# EAGLE design stm32-canstamp (EAGLE 5.12)

## Sheet 1 of 2
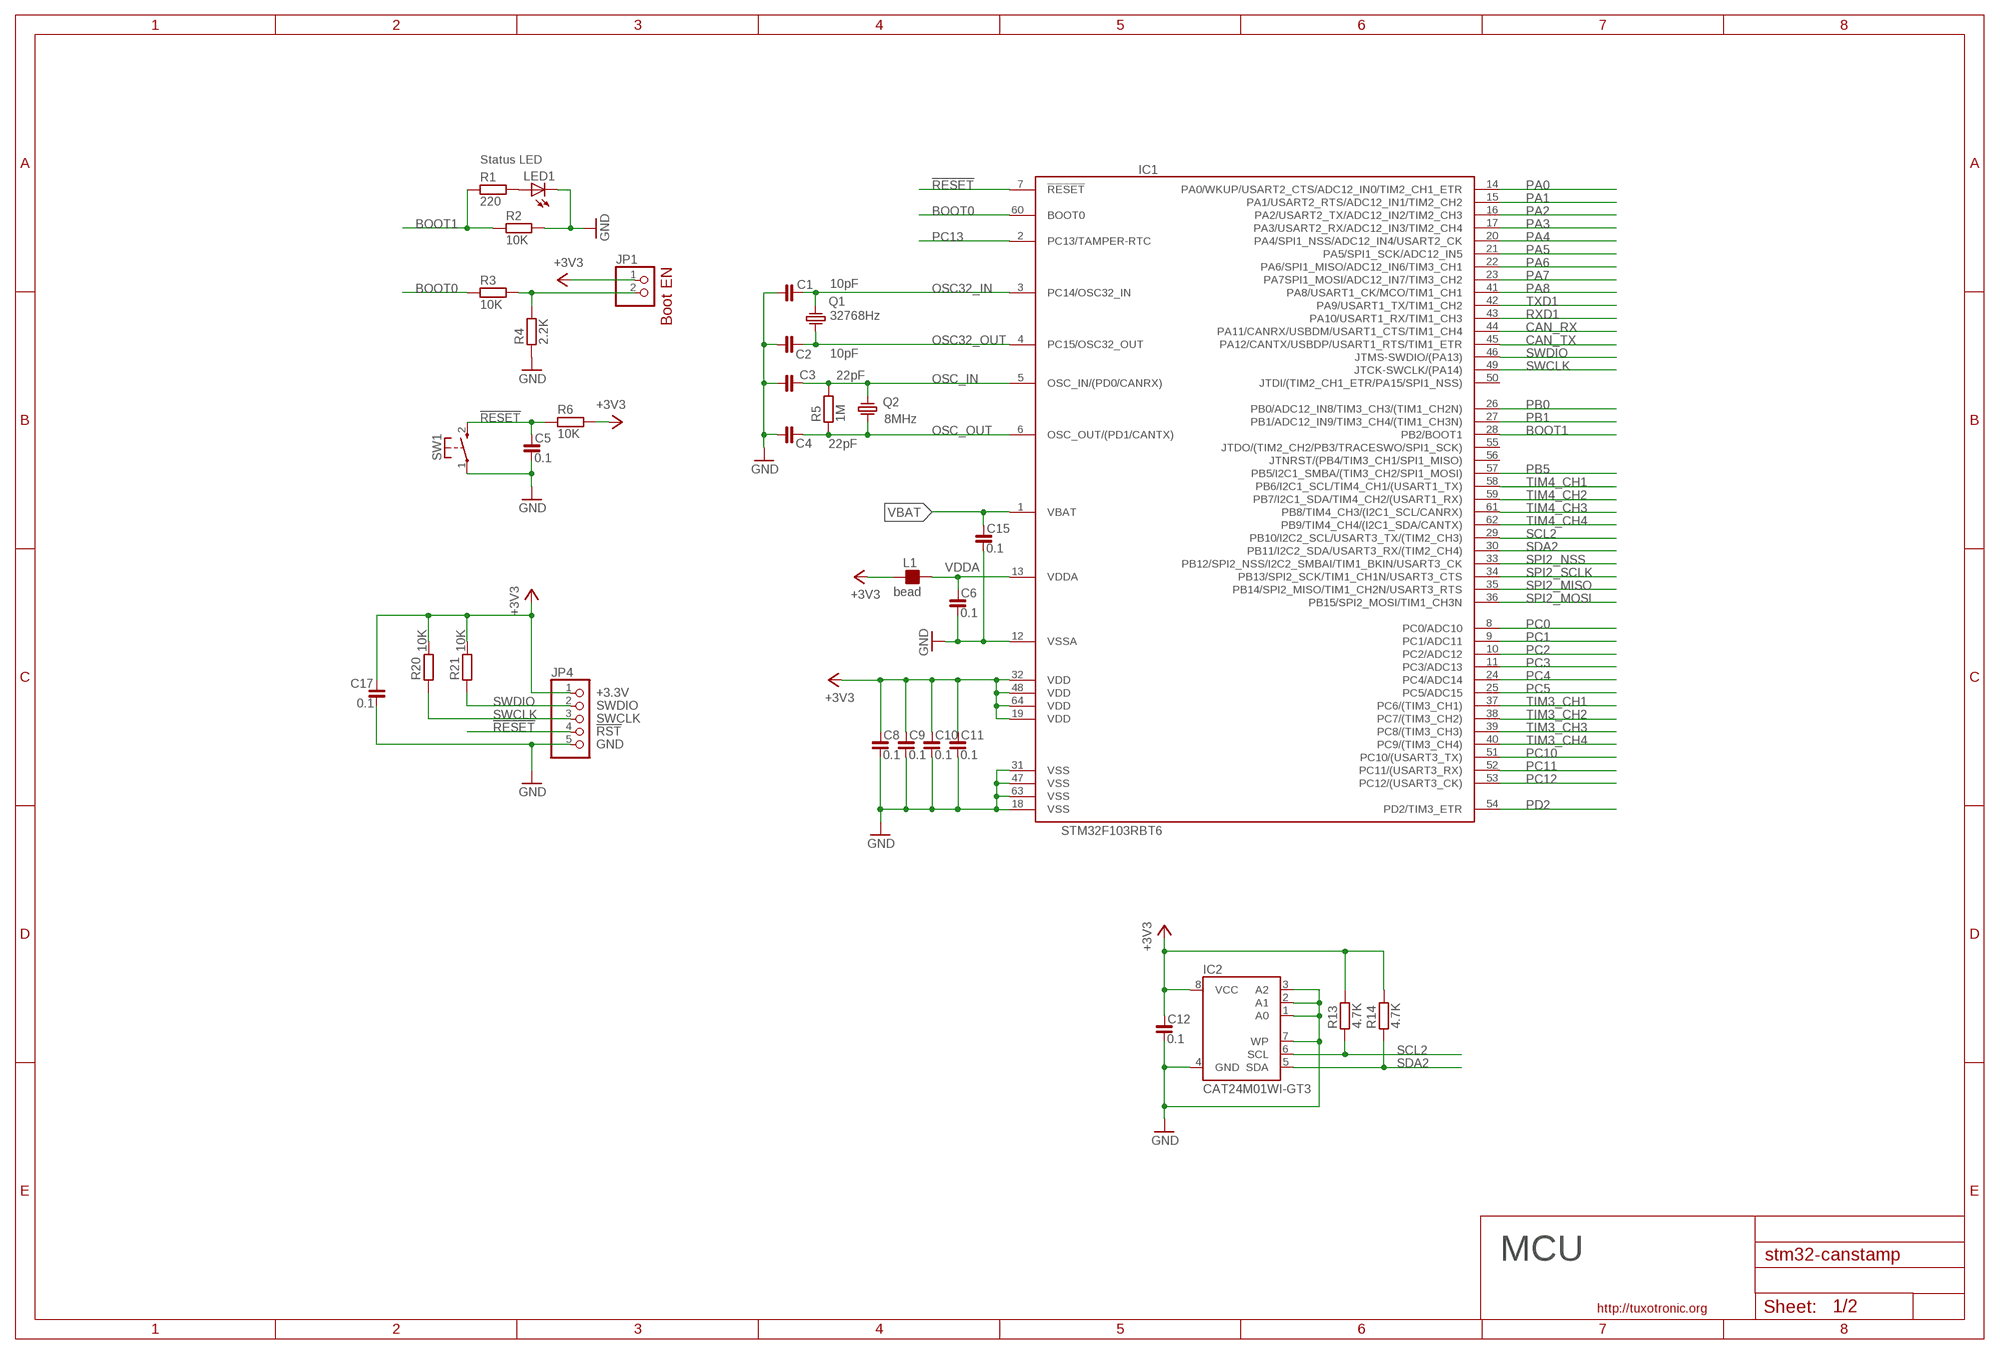
[diagram p0: schematic, sheet 1]

### Parts
C1  10pF  C_0603  [C0603]
C2  10pF  C_0603  [C0603]
C3  22pF  C_0603  [C0603]
C4  22pF  C_0603  [C0603]
C5  0.1  C_0603  [C0603]
C6  0.1  C_0603  [C0603]
C8  0.1  C_0603  [C0603]
C9  0.1  C_0603  [C0603]
C10  0.1  C_0603  [C0603]
C11  0.1  C_0603  [C0603]
C12  0.1  C_0603  [C0603]
C15  0.1  C_0603  [C0603]
C17  0.1  C_0603  [C0603]
IC1  STM32F103RBT6  STM32F103R  [TQFP64]
IC2  CAT24M01WI-GT3  AT24C256S  [SO08]
JP1  PINHD-1X2_2.00  [1X02M]
JP4  SWD-5_2.54  [1X05]
L1  bead  FB_0603  [L0603]
LED1  LEDCHIP-LED0805  [CHIP-LED0805]
Q1  32768Hz  CRYSTAL-TC26H  [TC26H]
Q2  8MHz  CRYSTAL-HC49S  [HC49/S]
R1  220  R_0603  [R0603]
R2  10K  R_0603  [R0603]
R3  10K  R_0603  [R0603]
R4  2.2K  R_0603  [R0603]
R5  1M  R_0603  [R0603]
R6  10K  R_0603  [R0603]
R13  4.7K  R_0603  [R0603]
R14  4.7K  R_0603  [R0603]
R20  10K  R_0603  [R0603]
R21  10K  R_0603  [R0603]
SW1  KSS-2EG4430  [KSS-2EG4430]

### Nets
!RESET: C5.1 IC1.7(!RESET) JP4.4 R6.1 SW1.2(S)
+3V3: C8.1 C9.1 C10.1 C11.1 C12.1 C17.1 IC1.19(VDD) IC1.32(VDD) IC1.48(VDD) IC1.64(VDD) IC2.8(VCC) JP1.1 JP4.1 L1.1 R6.2 R13.2 R14.2 R20.2 R21.2 ; also sheet 2
BOOT0: IC1.60(BOOT0) R3.1
BOOT1: IC1.28(PB2/BOOT1) R1.1 R2.1
CAN_RX: IC1.44(PA11/CANRX/USBDM/USART1_CTS/TIM1_CH4) ; also sheet 2
CAN_TX: IC1.45(PA12/CANTX/USBDP/USART1_RTS/TIM1_ETR) ; also sheet 2
GND: C1.2 C2.2 C3.2 C4.2 C5.2 C6.2 C8.2 C9.2 C10.2 C11.2 C12.2 C15.2 C17.2 IC1.12(VSSA) IC1.18(VSS) IC1.31(VSS) IC1.47(VSS) IC1.63(VSS) IC2.1(A0) IC2.2(A1) IC2.3(A2) IC2.4(GND) IC2.7(WP) JP4.5 LED1.C R2.2 R4.1 SW1.1(P) ; also sheet 2
N$3: JP1.2 R3.2 R4.2
N$30: LED1.A R1.2
OSC32_IN: C1.1 IC1.3(PC14/OSC32_IN) Q1.2 ; also sheet 2
OSC32_OUT: C2.1 IC1.4(PC15/OSC32_OUT) Q1.1 ; also sheet 2
OSC_IN: C3.1 IC1.5(OSC_IN/(PD0/CANRX)) Q2.1 R5.2
OSC_OUT: C4.1 IC1.6(OSC_OUT/(PD1/CANTX)) Q2.2 R5.1
PA0: IC1.14(PA0/WKUP/USART2_CTS/ADC12_IN0/TIM2_CH1_ETR) ; also sheet 2
PA1: IC1.15(PA1/USART2_RTS/ADC12_IN1/TIM2_CH2) ; also sheet 2
PA2: IC1.16(PA2/USART2_TX/ADC12_IN2/TIM2_CH3) ; also sheet 2
PA3: IC1.17(PA3/USART2_RX/ADC12_IN3/TIM2_CH4) ; also sheet 2
PA4: IC1.20(PA4/SPI1_NSS/ADC12_IN4/USART2_CK) ; also sheet 2
PA5: IC1.21(PA5/SPI1_SCK/ADC12_IN5) ; also sheet 2
PA6: IC1.22(PA6/SPI1_MISO/ADC12_IN6/TIM3_CH1) ; also sheet 2
PA7: IC1.23(PA7SPI1_MOSI/ADC12_IN7/TIM3_CH2) ; also sheet 2
PA8: IC1.41(PA8/USART1_CK/MCO/TIM1_CH1)
PB0: IC1.26(PB0/ADC12_IN8/TIM3_CH3/(TIM1_CH2N)) ; also sheet 2
PB1: IC1.27(PB1/ADC12_IN9/TIM3_CH4/(TIM1_CH3N)) ; also sheet 2
PB5: IC1.57(PB5/I2C1_SMBA/(TIM3_CH2/SPI1_MOSI)) ; also sheet 2
PC0: IC1.8(PC0/ADC10) ; also sheet 2
PC1: IC1.9(PC1/ADC11) ; also sheet 2
PC2: IC1.10(PC2/ADC12) ; also sheet 2
PC3: IC1.11(PC3/ADC13) ; also sheet 2
PC4: IC1.24(PC4/ADC14) ; also sheet 2
PC5: IC1.25(PC5/ADC15) ; also sheet 2
PC10: IC1.51(PC10/(USART3_TX)) ; also sheet 2
PC11: IC1.52(PC11/(USART3_RX)) ; also sheet 2
PC12: IC1.53(PC12/(USART3_CK)) ; also sheet 2
PC13: IC1.2(PC13/TAMPER-RTC) ; also sheet 2
PD2: IC1.54(PD2/TIM3_ETR) ; also sheet 2
RXD1: IC1.43(PA10/USART1_RX/TIM1_CH3)
SCL2: IC1.29(PB10/I2C2_SCL/USART3_TX/(TIM2_CH3)) IC2.6(SCL) R13.1 ; also sheet 2
SDA2: IC1.30(PB11/I2C2_SDA/USART3_RX/(TIM2_CH4)) IC2.5(SDA) R14.1 ; also sheet 2
SPI2_MISO: IC1.35(PB14/SPI2_MISO/TIM1_CH2N/USART3_RTS) ; also sheet 2
SPI2_MOSI: IC1.36(PB15/SPI2_MOSI/TIM1_CH3N) ; also sheet 2
SPI2_NSS: IC1.33(PB12/SPI2_NSS/I2C2_SMBAI/TIM1_BKIN/USART3_CK) ; also sheet 2
SPI2_SCLK: IC1.34(PB13/SPI2_SCK/TIM1_CH1N/USART3_CTS) ; also sheet 2
SWCLK: IC1.49(JTCK-SWCLK/(PA14)) JP4.3 R20.1
SWDIO: IC1.46(JTMS-SWDIO/(PA13)) JP4.2 R21.1
TIM3_CH1: IC1.37(PC6/(TIM3_CH1)) ; also sheet 2
TIM3_CH2: IC1.38(PC7/(TIM3_CH2)) ; also sheet 2
TIM3_CH3: IC1.39(PC8/(TIM3_CH3)) ; also sheet 2
TIM3_CH4: IC1.40(PC9/(TIM3_CH4)) ; also sheet 2
TIM4_CH1: IC1.58(PB6/I2C1_SCL/TIM4_CH1/(USART1_TX)) ; also sheet 2
TIM4_CH2: IC1.59(PB7/I2C1_SDA/TIM4_CH2/(USART1_RX)) ; also sheet 2
TIM4_CH3: IC1.61(PB8/TIM4_CH3/(I2C1_SCL/CANRX)) ; also sheet 2
TIM4_CH4: IC1.62(PB9/TIM4_CH4/(I2C1_SDA/CANTX)) ; also sheet 2
TXD1: IC1.42(PA9/USART1_TX/TIM1_CH2)
VBAT: C15.1 IC1.1(VBAT) ; also sheet 2
VDDA: C6.1 IC1.13(VDDA) L1.2 ; also sheet 2
Unconnected: IC1.50(JTDI/(TIM2_CH1_ETR/PA15/SPI1_NSS)) IC1.55(JTDO/(TIM2_CH2/PB3/TRACESWO/SPI1_SCK)) IC1.56(JTNRST/(PB4/TIM3_CH1/SPI1_MISO))

### Notes on the sheet
- Status LED
- Boot EN
- MCU

## Sheet 2 of 2
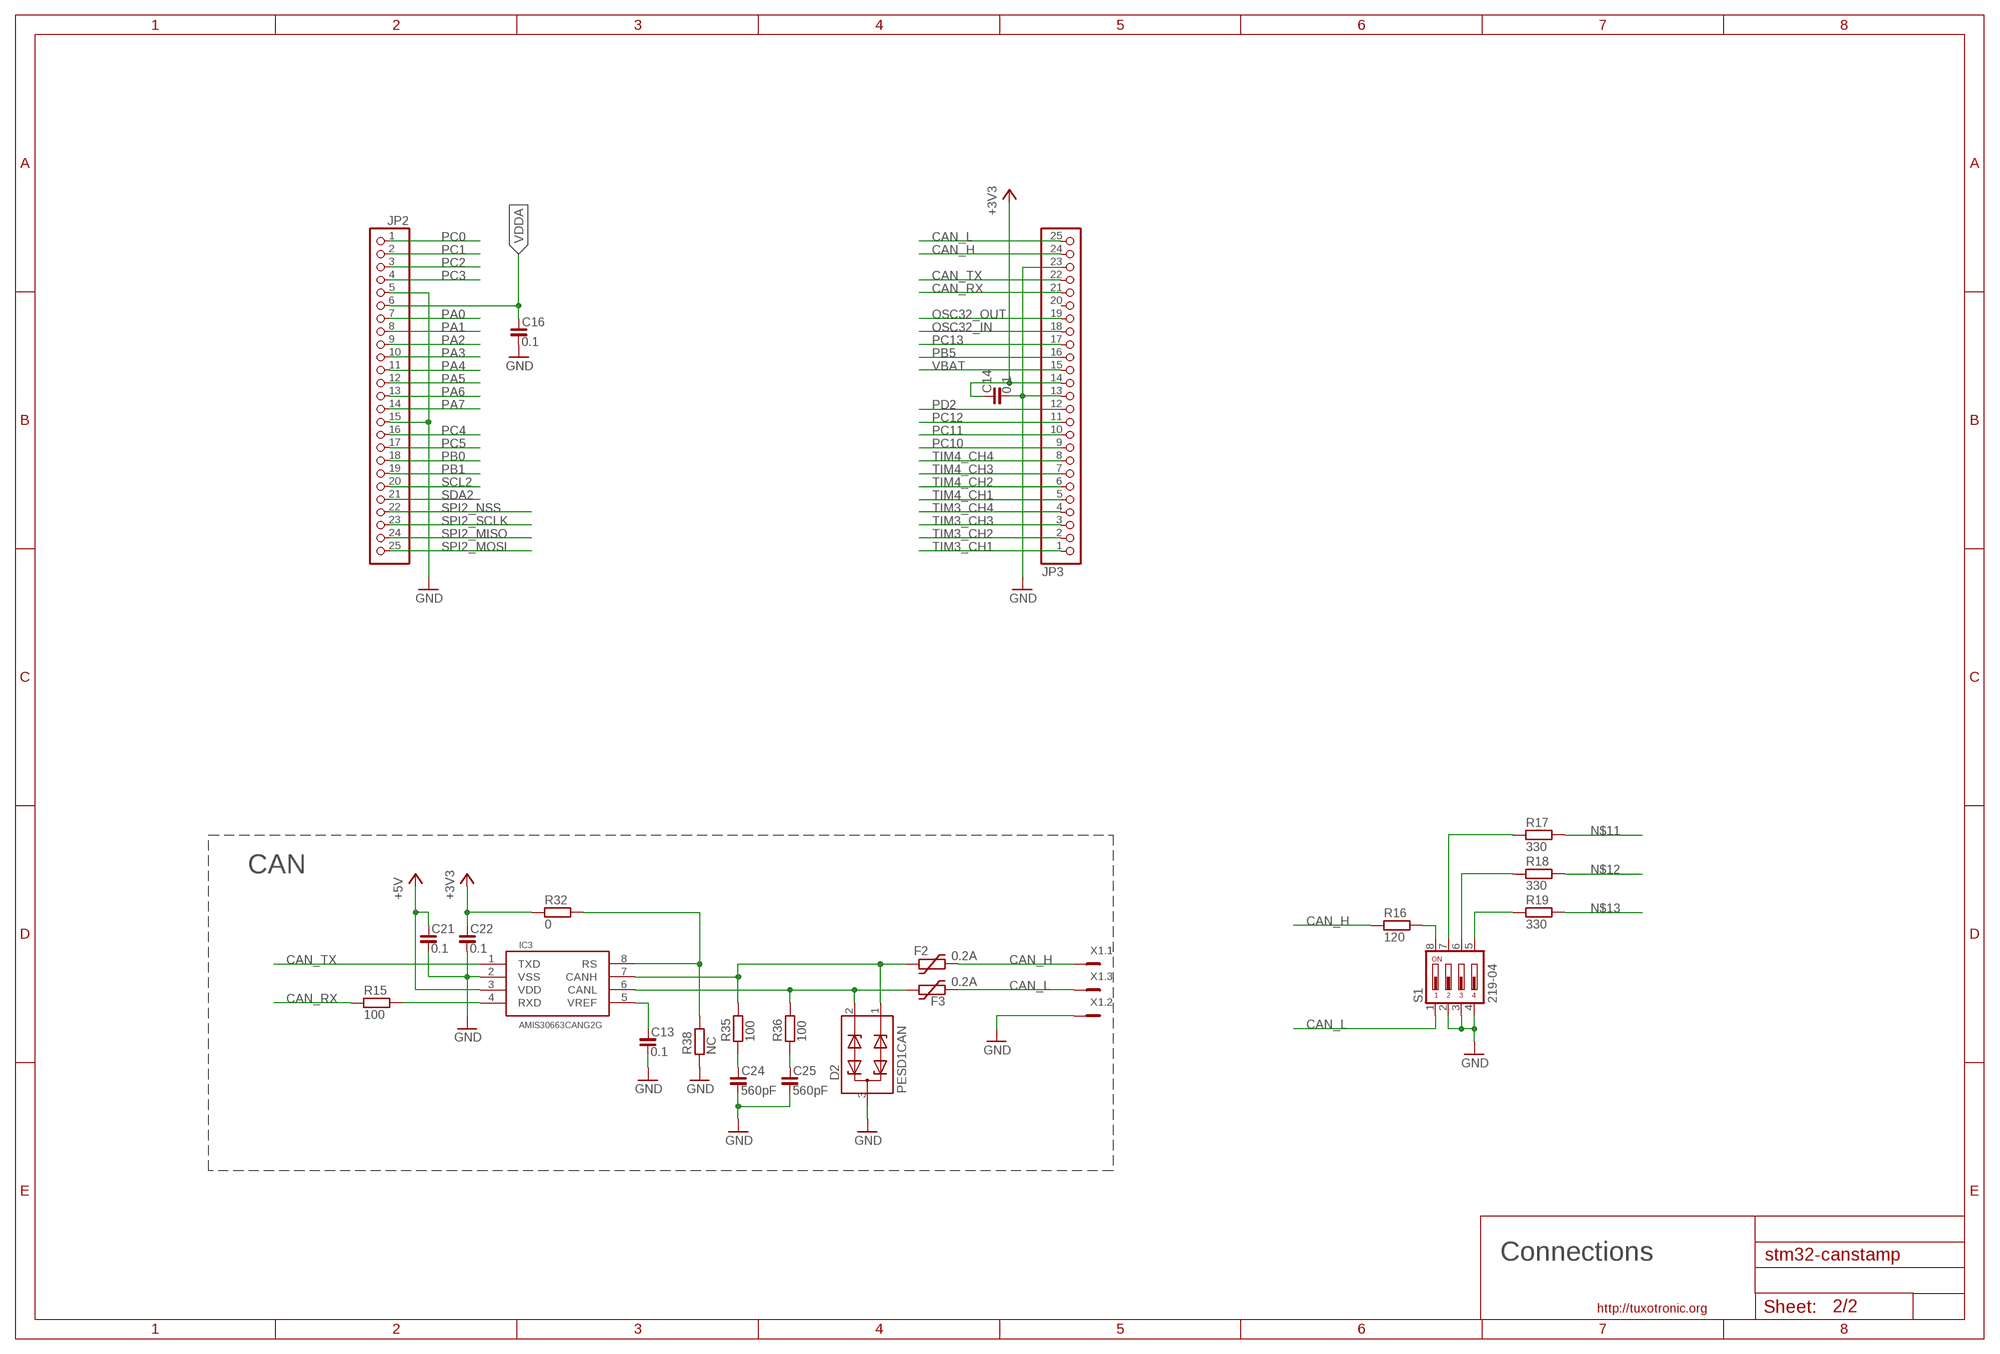
[diagram p1: schematic, sheet 2]

### Parts
C13  0.1  C_0603  [C0603]
C14  0.1  C_0603  [C0603]
C16  0.1  C_0603  [C0603]
C21  0.1  C_0603  [C0603]
C22  0.1  C_0603  [C0603]
C24  560pF  C_0603  [C0603]
C25  560pF  C_0603  [C0603]
D2  PESD1CAN  [SOT23]
F2  0.2A  1812L  [1812L]
F3  0.2A  1812L  [1812L]
IC3  AMIS30663CANG2G  SN65HVD230  [SO08]
JP2  PINHD-1X25_2.00  [1X25M]
JP3  PINHD-1X25_2.00  [1X25M]
R15  100  R_0603  [R0603]
R16  120  R_0805  [R0805]
R17  330  R_0603  [R0603]
R18  330  R_0603  [R0603]
R19  330  R_0603  [R0603]
R32  0  R_0603  [R0603]
R35  100  R_0603  [R0603]
R36  100  R_0603  [R0603]
R38  NC  R_0603  [R0603]
S1  219-04  [CTS-219-04]
X1  MCV3  [MCV3]

### Nets
+3V3: C14.1 C22.1 JP3.14 R32.1 ; also sheet 1
+5V: C21.1 IC3.3(VDD)
CAN_CTRL: IC3.8(RS) R32.2 R38.2
CAN_H: F2.P$2 JP3.24 R16.1 X1.1
CAN_L: F3.P$2 JP3.25 S1.1 X1.3
CAN_RX: JP3.21 R15.1 ; also sheet 1
CAN_TX: IC3.1(TXD) JP3.22 ; also sheet 1
GND: C13.2 C14.2 C16.2 C21.2 C22.2 C24.2 C25.2 D2.3 IC3.2(VSS) JP2.5 JP2.15 JP3.13 JP3.23 R38.1 S1.2 S1.3 S1.4 X1.2 ; also sheet 1
N$1: C13.1 IC3.5(VREF)
N$2: R16.2 S1.8
N$7: IC3.4(RXD) R15.2
N$8: R17.1 S1.7
N$9: R18.1 S1.6
N$10: R19.1 S1.5
N$11: R17.2
N$12: R18.2
N$13: R19.2
N$51: D2.1 F2.P$1 IC3.7(CANH) R35.2
N$52: D2.2 F3.P$1 IC3.6(CANL) R36.2
N$54: C25.1 R36.1
N$55: C24.1 R35.1
OSC32_IN: JP3.18 ; also sheet 1
OSC32_OUT: JP3.19 ; also sheet 1
PA0: JP2.7 ; also sheet 1
PA1: JP2.8 ; also sheet 1
PA2: JP2.9 ; also sheet 1
PA3: JP2.10 ; also sheet 1
PA4: JP2.11 ; also sheet 1
PA5: JP2.12 ; also sheet 1
PA6: JP2.13 ; also sheet 1
PA7: JP2.14 ; also sheet 1
PB0: JP2.18 ; also sheet 1
PB1: JP2.19 ; also sheet 1
PB5: JP3.16 ; also sheet 1
PC0: JP2.1 ; also sheet 1
PC1: JP2.2 ; also sheet 1
PC2: JP2.3 ; also sheet 1
PC3: JP2.4 ; also sheet 1
PC4: JP2.16 ; also sheet 1
PC5: JP2.17 ; also sheet 1
PC10: JP3.9 ; also sheet 1
PC11: JP3.10 ; also sheet 1
PC12: JP3.11 ; also sheet 1
PC13: JP3.17 ; also sheet 1
PD2: JP3.12 ; also sheet 1
SCL2: JP2.20 ; also sheet 1
SDA2: JP2.21 ; also sheet 1
SPI2_MISO: JP2.24 ; also sheet 1
SPI2_MOSI: JP2.25 ; also sheet 1
SPI2_NSS: JP2.22 ; also sheet 1
SPI2_SCLK: JP2.23 ; also sheet 1
TIM3_CH1: JP3.1 ; also sheet 1
TIM3_CH2: JP3.2 ; also sheet 1
TIM3_CH3: JP3.3 ; also sheet 1
TIM3_CH4: JP3.4 ; also sheet 1
TIM4_CH1: JP3.5 ; also sheet 1
TIM4_CH2: JP3.6 ; also sheet 1
TIM4_CH3: JP3.7 ; also sheet 1
TIM4_CH4: JP3.8 ; also sheet 1
VBAT: JP3.15 ; also sheet 1
VDDA: C16.1 JP2.6 ; also sheet 1
Unconnected: JP3.20

### Notes on the sheet
- CAN
- Connections

## Library data of the parts
C1-C6 C8-C17 C21 C22 C24 C25 = rc-master-smd:C_: NON-POLARIZED CAP
D2 = protect:PESD1CAN: Features Due to the integrated diode structure only one small SOT23 package is needed to protect two CAN bus lines Max. peak pulse power: PPP = 200 W at tp = 8/20 ?s Low clamping voltage: VCL = 40 V at IPP = 1 A Ultra low leakage current: IRM < 1 nA ESD protection up to 23 kV IEC 61000-4-2, level 4 (ESD) IEC 61000-4-5 (surge); IPP = 3 A at tp = 8/20 ?s Small SMD plastic package Applications CAN bus protection Automotive applications
F2 F3 = discrete:1812L
IC1 = stm32:STM32F103R: Medium-density performance line ARM-based 32-bit MCU with 64 or 128 KB Flash, USB, CAN, 7 timers, 2 ADCs, 9 communication interfaces
IC2 = stm32-by-pb:AT24C*: 2-wire serial EEPROM
IC3 = interfaces:SN65HVD230: CAN PHY driver
JP1 = pinhead-fixdrills:PINHD-1X2: PIN HEADER
JP2 JP3 = pinhead-fixdrills:PINHD-1X25: PIN HEADER
JP4 = jtag:SWD-5: PIN HEADER
L1 = rc-master-smd:FB_: FERRITE BEAD
LED1 = led:LED: LED OSRAM: - CHIPLED LG R971, LG N971, LY N971, LG Q971, LY Q971, LO R971, LY R971 LH N974, LH R974 LS Q976, LO Q976, LY Q976 LO Q996 - Hyper CHIPLED LW Q18S LB Q993, LB Q99A, LB R99A - SideLED LS A670, LO A670, LY A670, LG A670, LP A670 LB A673, LV A673, LT A673, LW A673 LH A674 LY A675 LS A676, LA A676, LO A676, LY A676, LW A676 LS A679, LY A679, LG A679 - Hyper Micro SIDELED® LS Y876, LA Y876, LO Y876, LY Y876 LT Y87S - SmartLED LW L88C, LW L88S LB L89C, LB L89S, LG L890 LS L89K, LO L89K, LY L89K LS L896, LA L896, LO L896, LY L896 - TOPLED LS T670, LO T670, LY T670, LG T670, LP T670 LSG T670, LSP T670, LSY T670, LOP T670, LYG T670 LG T671, LOG T671, LSG T671 LB T673, LV T673, LT T673, LW T673 LH T674 LS T676, LA T676, LO T676, LY T676, LB T676, LH T676, LSB T676, LW T676 LB T67C, LV T67C, LT T67C, LS T67K, LO T67K, LY T67K, LW E67C LS E67B, LA E67B, LO E67B, LY E67B, LB E67C, LV E67C, LT E67C LW T67C LS T679, LY T679, LG T679 LS T770, LO T770, LY T770, LG T770, LP T770 LB T773, LV T773, LT T773, LW T773 LH T774 LS E675, LA E675, LY E675, LS T675 LS T776, LA T776, LO T776, LY T776, LB T776 LHGB T686 LT T68C, LB T68C - Hyper Mini TOPLED® LB M676 - Mini TOPLED Santana® LG M470 LS M47K, LO M47K, LY M47K Source: http://www.osram.convergy.de - LUMILED® LXK2-PW12-R00, LXK2-PW12-S00, LXK2-PW14-U00, LXK2-PW14-V00 LXK2-PM12-R00, LXK2-PM12-S00, LXK2-PM14-U00 LXK2-PE12-Q00, LXK2-PE12-R00, LXK2-PE12-S00, LXK2-PE14-T00, LXK2-PE14-U00 LXK2-PB12-K00, LXK2-PB12-L00, LXK2-PB12-M00, LXK2-PB14-N00, LXK2-PB14-P00, LXK2-PB14-Q00 LXK2-PR12-L00, LXK2-PR12-M00, LXK2-PR14-Q00, LXK2-PR14-R00 LXK2-PD12-Q00, LXK2-PD12-R00, LXK2-PD12-S00 LXK2-PH12-R00, LXK2-PH12-S00 LXK2-PL12-P00, LXK2-PL12-Q00, LXK2-PL12-R00 Source: www.luxeon.com
Q1 Q2 = discrete:CRYSTAL-: CRYSTAL
R1-R6 R13-R21 R32 R35 R36 R38 = rc-master-smd:R_: RESISTOR
S1 = switch-dil:219-04*: Surface Mount DIP Switch Series 219 SMT CTS Electronic Components Sourc: www.ctscorp.com
SW1 = buttons:KSS-2EG4430: Size: 3x6mm Height: 5mm from PCB Rating: DC12v 50mA Travel: 0.25±0.10mm Operating Force: 180±50gf Return Force: 60gf min Contact resistance: 100m? max Insulation resistance: 100M? min Operating life?50,000 cycles
X1 = con-phoenix-381_l:MCV3: Mini-Combicon 3.81mm vertikal 3polig (ohne Gegenstecker)

## Net classes
0 default: width 0.1 mm, drill 0.1 mm, clearance 0.1 mm

## Board
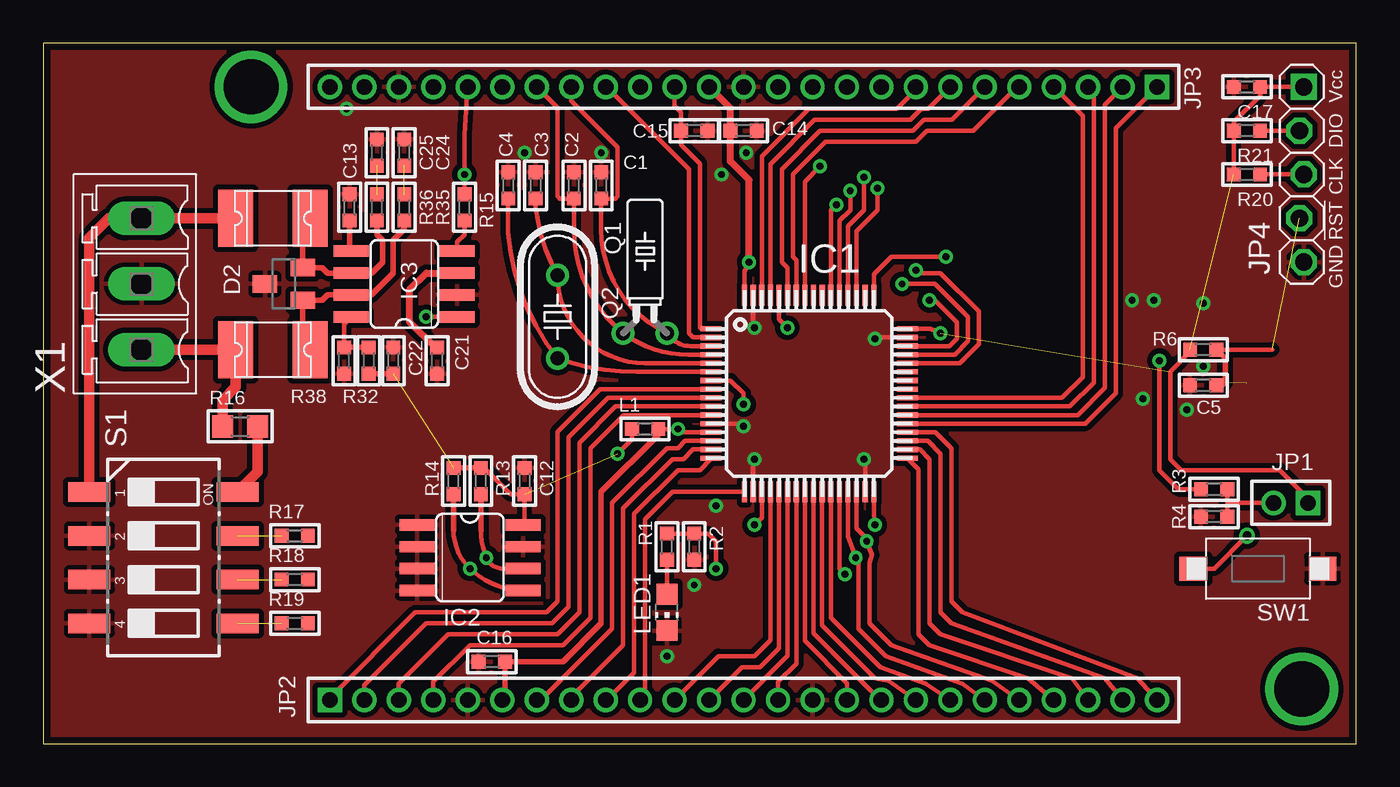
[diagram p2: board, top side]
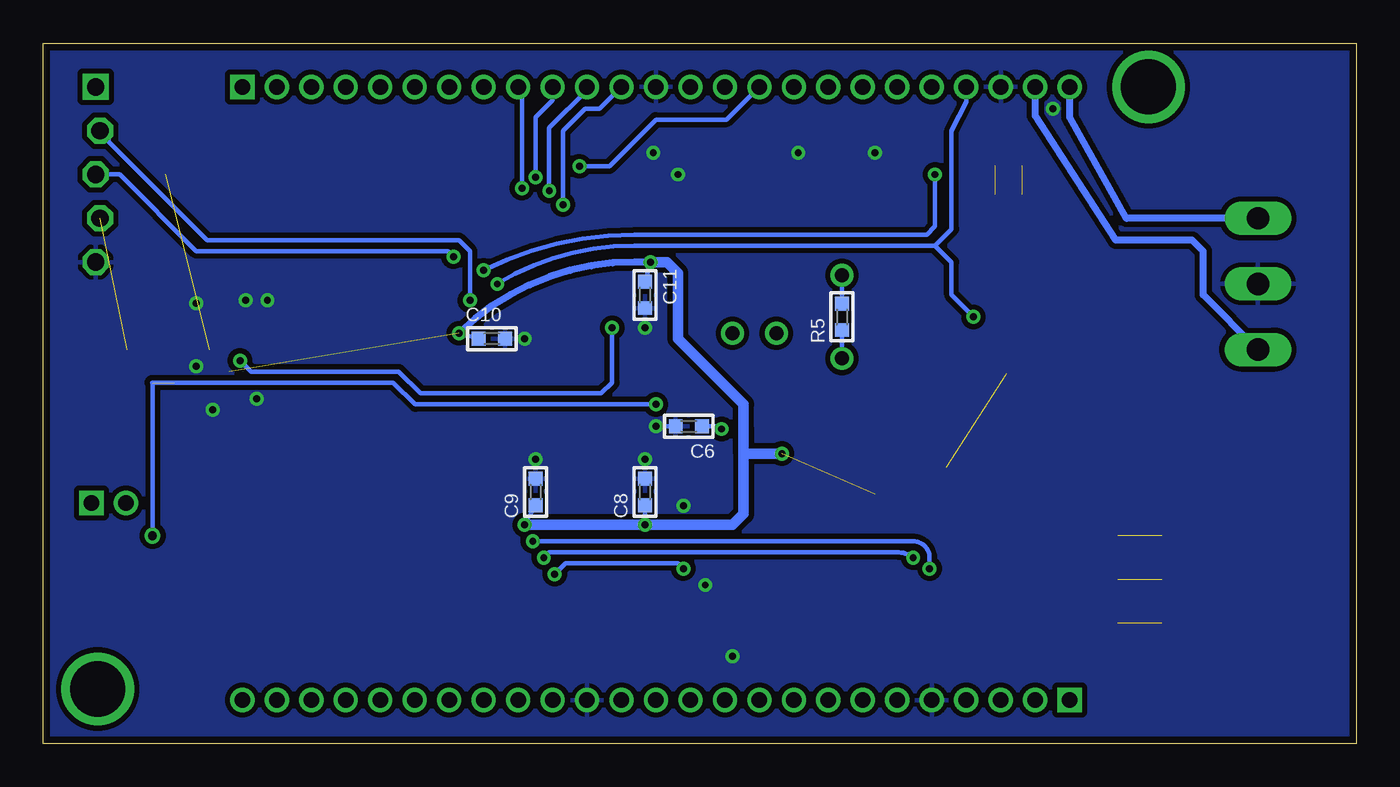
[diagram p3: board, bottom side, seen from below]

Size 76.2 x 40.64 mm. Coordinates in mm from the lower left corner, seen from the top.
Outline: 0,0 76.2,0 76.2,40.64 0,40.64 0,0
Copper layers (1*16): Top 0.035mm / dielectric 1.5mm / Bottom 0.035mm
Design rules "default *": minimum track width 0.16mm, minimum drill 0.4mm, track to track 0.16mm, track to pad 0.16mm, pad to pad 0.16mm, via to via 0.16mm, smd to smd 0.16mm, copper to edge 0.4mm, drill to drill 8mil, minimum pad ring 10mil, minimum via ring 8mil, stop-mask expansion 4mil, vias tented up to drill 0.6mm, thermal gap 10mil

### Footprints (pad centres in the part's own frame; a part is rotated, then mirrored left to right if it is on the bottom)
C0603 = smd 0.8 x 0.8: 1 -0.762,0; 2 0.762,0
SOT23 = smd 1 x 1.4: 1 -0.95,-1.1; 2 0.95,-1.1; 3 0,1.1
1812L = smd 2.03 x 3.3: P$1 -2.16,0; P$2 2.16,0
TQFP64 = smd 1.2 x 0.3: 1 -5.7,3.75; 2 -5.7,3.25; 3 -5.7,2.75; 4 -5.7,2.25; 5 -5.7,1.75; 6 -5.7,1.25; 7 -5.7,0.75; 8 -5.7,0.25; 9 -5.7,-0.25; 10 -5.7,-0.75; 11 -5.7,-1.25; 12 -5.7,-1.75; 13 -5.7,-2.25; 14 -5.7,-2.75; 15 -5.7,-3.25; 16 -5.7,-3.75; 33 5.7,-3.75; 34 5.7,-3.25; 35 5.7,-2.75; 36 5.7,-2.25; 37 5.7,-1.75; 38 5.7,-1.25; 39 5.7,-0.75; 40 5.7,-0.25; 41 5.7,0.25; 42 5.7,0.75; 43 5.7,1.25; 44 5.7,1.75; 45 5.7,2.25; 46 5.7,2.75; 47 5.7,3.25; 48 5.7,3.75 | smd 0.3 x 1.2: 17 -3.75,-5.7; 18 -3.25,-5.7; 19 -2.75,-5.7; 20 -2.25,-5.7; 21 -1.75,-5.7; 22 -1.25,-5.7; 23 -0.75,-5.7; 24 -0.25,-5.7; 25 0.25,-5.7; 26 0.75,-5.7; 27 1.25,-5.7; 28 1.75,-5.7; 29 2.25,-5.7; 30 2.75,-5.7; 31 3.25,-5.7; 32 3.75,-5.7; 49 3.75,5.7; 50 3.25,5.7; 51 2.75,5.7; 52 2.25,5.7; 53 1.75,5.7; 54 1.25,5.7; 55 0.75,5.7; 56 0.25,5.7; 57 -0.25,5.7; 58 -0.75,5.7; 59 -1.25,5.7; 60 -1.75,5.7; 61 -2.25,5.7; 62 -2.75,5.7; 63 -3.25,5.7; 64 -3.75,5.7
SO08 = smd 0.66 x 2.032: 1 -1.905,-3.073; 2 -0.635,-3.073; 3 0.635,-3.073; 4 1.905,-3.073; 5 1.905,3.073; 6 0.635,3.073; 7 -0.635,3.073; 8 -1.905,3.073
1X02M = drill 0.9 square: 1 -1,0 | drill 0.9 round: 2 1,0
1X25M = drill 0.9 square: 1 -24,0 | drill 0.9 round: 2 -22,0; 3 -20,0; 4 -18,0; 5 -16,0; 6 -14,0; 7 -12,0; 8 -10,0; 9 -8,0; 10 -6,0; 11 -4,0; 12 -2,0; 13 0,0; 14 2,0; 15 4,0; 16 6,0; 17 8,0; 18 10,0; 19 12,0; 20 14,0; 21 16,0; 22 18,0; 23 20,0; 24 22,0; 25 24,0
1X05 = drill 1 square: 1 -5.08,0.127 | drill 1 octagon: 2 -2.54,-0.127; 3 0,0.127; 4 2.54,-0.127; 5 5.08,0.127
L0603 = smd 0.8 x 0.8: 1 -0.762,0; 2 0.762,0
CHIP-LED0805 = smd 1.2 x 1.2: A 0,-1.05; C 0,1.05
TC26H = drill 0.813 round: 1 -1.27,0; 2 1.27,0
HC49/S = drill 0.813 round: 1 -2.413,0; 2 2.413,0
R0603 = smd 0.8 x 0.8: 1 -0.762,0; 2 0.762,0
R0805 = smd 1.2 x 1.3: 1 -1.016,0; 2 1.016,0
CTS-219-04 = smd 1.13 x 2.44: 1 -3.81,-4.3; 2 -1.27,-4.3; 3 1.27,-4.3; 4 3.81,-4.3; 5 3.81,4.3; 6 1.27,4.3; 7 -1.27,4.3; 8 -3.81,4.3
KSS-2EG4430 = smd 1.6 x 1.4: 1 -3.75,0; 2 3.75,0
MCV3 = drill 1.3 pad 1.905 long: 1 -3.81,0; 2 0,0; 3 3.81,0

### Placement (x,y rotation side)
C1  32.38,32.38 90 top
C2  30.8,32.38 90 top
C3  28.57,32.38 90 top
C4  26.99,32.39 90 top
C5  67.31,20.8 180 top
C6  38.73,18.41 180 bottom
C8  41.27,14.61 90 bottom
C9  47.62,14.61 90 bottom
C10  50.16,23.5 0 bottom
C11  41.27,26.04 270 bottom
C12  27.94,15.24 90 top
C13  17.78,31.11 90 top
C14  40.64,35.56 0 top
C15  37.78,35.56 0 top
C16  26.04,4.76 180 top
C17  69.85,38.1 180 top
C21  22.86,22.23 270 top
C22  20.32,22.23 90 top
C24  20.96,34.29 90 top
C25  19.37,34.29 90 top
D2  13.97,26.67 90 top
F2  13.34,22.86 180 top
F3  13.34,30.48 180 top
IC1  44.45,20.32 0 top
IC2  24.77,10.79 270 top
IC3  20.96,26.67 90 top
JP1  72.39,13.97 180 top
JP2  40.64,2.54 0 top
JP3  40.64,38.1 180 top
JP4  73.02,33.02 270 top
L1  34.93,18.26 0 top
LED1  36.2,7.62 180 top
Q1  34.93,23.81 0 top
Q2  29.84,24.77 270 top
R1  36.2,11.43 270 top
R2  37.78,11.43 270 top
R3  67.94,14.76 0 top
R4  67.94,13.18 0 top
R5  29.84,24.77 90 bottom
R6  67.31,22.86 180 top
R13  25.4,15.24 90 top
R14  23.81,15.24 90 top
R15  24.45,31.11 270 top
R16  11.43,18.41 0 top
R17  14.61,12.06 0 top
R18  14.61,9.53 0 top
R19  14.61,6.99 0 top
R20  69.85,33.02 180 top
R21  69.85,35.56 180 top
R32  18.89,22.23 90 top
R35  20.96,31.11 270 top
R36  19.37,31.11 270 top
R38  17.46,22.23 90 top
S1  6.99,10.79 270 top
SW1  70.48,10.16 180 top
X1  5.72,26.67 90 top

### Tracks (layer width: path | path; a pad name or v marks a point on that pad's centre or on a via)
!RESET  (via drill 0.4, 0.5)  (2 unrouted)
  Top 0.254: IC1.7 39.89,21.07 40.64,20.32 v40.64,19.68 | R6.1 71.31,22.86 | SW1.2 67.94,10.16 v69.85,12.06
  Top 0.305: C5.1 68.42,20.8 68.58,20.95 68.58,22.35 R6.1
  Bottom 0.254: v40.64,19.68 54.61,19.68 55.88,20.95 69.88,20.95 69.85,20.92 v69.85,12.06
+3V3  (via drill 0.4)  (4 unrouted)
  Top 0.254: IC1.64 40.7,27.36 v40.96,27.94 | IC1.19 41.7,13.12 v41.27,12.7 | IC1.32 48.2,13.28 v48.26,12.7 | IC1.48 51.49,24.07 v52.07,23.81 | R13.2 25.59,16 27.11,14.48 C12.1 27.94,12.8 IC2.8 | L1.1 34.16,17.65 v33.34,16.83 | JP1.1 73.39,14.24 71.75,15.88 66.04,15.88 65.4,16.51 65.4,21.59 66.55,22.73 R6.2 | JP4.1 C17.1 70.61,37.59 69.09,36.07 R21.2 R20.2
  Top 0.305: R32.1 C22.1 | R13.2 R14.2
  Top 0.406: JP3.14 39.88,36.86 C14.1 39.88,33.78 40.96,32.7 v40.96,27.94
  Bottom 0.254: v40.96,27.94 C11.1 | v41.27,12.7 C8.1 | v48.26,12.7 C9.1 | v52.07,23.81 C10.1
  Bottom 0.406: v40.96,27.94 41.91,27.94 arc-44 v52.07,23.81
  Bottom 0.61: 35.56,18.26 35.56,13.34 36.2,12.7 v41.27,12.7 v48.26,12.7 | 35.56,18.26 35.56,19.68 39.37,23.5 39.37,27.3 40.01,27.94 v40.96,27.94 | v33.34,16.83 35.56,16.83 35.56,18.26
+5V
  Top 0.406: IC3.3 22.23,27.3 21.27,26.35 21.27,24.45 22.73,22.99 C21.1
BOOT0  (via drill 0.4)
  Top 0.254: IC1.60 42.7,24.61 v43.18,24.13 | v64.77,22.23 64.77,15.88 65.88,14.76 R3.1
  Bottom 0.254: v43.18,24.13 43.18,20.95 43.81,20.32 54.29,20.32 55.56,21.59 64.13,21.59 v64.77,22.23
BOOT1  (via drill 0.4)
  Top 0.254: R1.1 R2.1 38.61,12.19 39.05,11.75 v39.05,10.16 | IC1.28 46.2,10.16 v46.51,9.84
  Bottom 0.254: v46.51,9.84 45.88,10.48 39.37,10.48 v39.05,10.16
CAN_CTRL
  Top 0.254: R38.2 17.46,24.35 IC3.8
  Top 0.305: R38.2 R32.2
CAN_H
  Top 0.61: F2.P$2 X1.1 | F2.P$2 11.43,22.86 | F2.P$2 11.18,20.7 10.41,19.94 R16.1
  Bottom 0.406: JP3.24 18.64,36.42 13.97,29.21 9.52,29.21 8.89,28.57 8.89,26.04 X1.1
CAN_L
  Top 0.61: F3.P$2 X1.3 3.81,30.48 2.68,29.36 S1.1
  Bottom 0.406: JP3.25 16.64,36.33 13.34,30.48 X1.3
CAN_RX  (via drill 0.4)
  Top 0.254: IC1.44 53.19,22.07 54.29,23.18 54.29,25.08 52.07,27.3 50.8,27.3 v50.64,27.46 | R15.1 v24.45,33.02 24.45,35.37 JP3.21
  Bottom 0.254: v50.64,27.46 arc27 41.91,29.53 24.92,29.53 24.45,30 v24.45,33.02
CAN_TX  (via drill 0.4)
  Top 0.254: IC1.45 52.89,22.57 53.66,23.34 53.66,24.77 51.75,26.67 v49.85,26.67 | v22.23,24.77 IC3.1
  Bottom 0.254: v49.85,26.67 arc31 41.91,28.89 24.45,28.89 | JP3.22 22.64,37.24 23.5,35.56 23.5,29.84 24.45,28.89 | 24.45,28.89 23.5,27.94 23.5,26.04 v22.23,24.77
GND  (via drill 0.4)
  Top 0.254: IC1.31 47.7,16.43 v47.62,16.51 | IC1.47 48.34,23.57 v48.26,23.5 | IC1.63 41.2,24.2 v41.27,24.13 | IC1.18 41.2,16.43 v41.27,16.51 | IC1.12 40.48,18.57 v40.64,18.41
  Bottom 0.254: C6.2 v40.64,18.41
  other vias: 67.31,25.56 64.45,25.72 63.18,25.72 40.8,34.29 39.37,33.02 39.05,13.81 37.78,9.21 17.62,36.83 32.38,34.29 27.94,34.29 36.2,5.08 66.36,19.37 63.82,20 67.31,21.91
  pour Top (isolate 0.305): 76.83,0 0,0 0,40.64 76.83,40.64
  pour Bottom (isolate 0.305): 76.83,0 0,0 0,40.64 76.83,40.64
N$1
  Top 0.305: C13.1 17.78,28.68 IC3.5
N$2
  Top 0.61: 11.43,14.75 S1.8 12.45,15.77 R16.2
N$3
  Top 0.254: R4.2 68.71,13.97 | 68.71,13.97 R3.2 | 68.71,13.97 JP1.2
N$4  (via drill 3.2)
  other vias: 12.07,38.1
N$5  (via drill 3.2)
  other vias: 73.02,3.17
N$7
  Top 0.254: IC3.4 24.03,29.11 24.45,29.53 R15.2
N$8  (1 unrouted)
N$9  (1 unrouted)
N$10  (1 unrouted)
N$30
  Top 0.254: LED1.A R1.2
N$51
  Top 0.305: F2.P$1 15.07,23.29 D2.1 16.2,25.72 16.51,26.04 IC3.7 19.05,26.04 20.32,27.3 20.32,29.21 20.96,29.84 R35.2
N$52
  Top 0.305: F3.P$1 15.07,30.05 D2.2 16.2,27.62 16.51,27.3 IC3.6 19.05,27.3 19.69,27.94 19.69,29.21 19.37,29.53 R36.2
N$54  (1 unrouted)
N$55  (1 unrouted)
OSC32_IN
  Top 0.254: IC1.3 37.57,23.07 arc-57 Q1.2 arc-65 32.38,29.84 C1.1 33.21,31.62 33.34,31.75 33.34,34.61 30.64,37.3 JP3.18
OSC32_OUT
  Top 0.254: IC1.4 37.44,22.57 arc-36 Q1.1 arc-51 30.8,29.84 C2.1 29.97,31.62 29.84,31.75 29.84,36.9 JP3.19
OSC_IN
  Top 0.254: IC1.5 34.93,22.07 arc-90 Q2.1 arc-22 28.57,31.11 C3.1
  Bottom 0.254: R5.2 Q2.1
OSC_OUT
  Top 0.254: IC1.6 34.44,21.57 arc-19 Q2.2 arc-34 26.99,29.66 C4.1
  Bottom 0.254: Q2.2 R5.1
PA0
  Top 0.254: IC1.14 37.26,17.57 36.83,17.14 36.2,17.14 33.02,13.97 33.02,6.67 28.64,2.29 JP2.7
PA1
  Top 0.254: IC1.15 37.71,17.07 37.15,16.51 36.51,16.51 33.66,13.65 33.66,5.71 30.64,2.7 JP2.8
PA2
  Top 0.254: IC1.16 38.75,16.52 38.1,15.88 36.83,15.88 34.29,13.34 34.29,4.13 32.64,2.48 JP2.9
PA3
  Top 0.254: IC1.17 36.53,14.62 34.93,13.02 34.93,3.17 34.64,2.89 JP2.10
PA4
  Top 0.254: IC1.20 42.2,6 41.27,5.08 39.18,5.08 JP2.11
PA5
  Top 0.254: IC1.21 42.7,5.55 41.59,4.45 40.55,4.45 JP2.12
PA6
  Top 0.254: IC1.22 43.2,5.1 JP2.13
PA7
  Top 0.254: IC1.23 43.7,4.65 42.64,3.59 JP2.14
PB0
  Top 0.254: IC1.26 45.2,6.87 48.26,3.81 49.05,3.65 JP2.18
PB1
  Top 0.254: IC1.27 45.7,7.32 48.58,4.45 51.21,3.49 JP2.19
PB5  (via drill 0.4)
  Top 0.254: IC1.57 44.2,32.61 v45.09,33.5
  Bottom 0.254: v45.09,33.5 43.34,33.5 40.64,36.2 36.55,36.2 JP3.16
PC0
  Top 0.254: IC1.8 32.32,20.57 29.84,18.1 29.84,8.26 29.21,7.62 21.59,7.62 16.64,2.67 JP2.1
PC1
  Top 0.254: IC1.9 32.77,20.07 30.48,17.78 30.48,7.94 29.53,6.99 22.23,6.99 18.64,3.4 JP2.2
PC2
  Top 0.254: IC1.10 33.22,19.57 31.12,17.46 31.12,7.62 29.84,6.35 23.5,6.35 20.64,3.5 JP2.3
PC3
  Top 0.254: IC1.11 33.68,19.07 31.75,17.14 31.75,7.3 30.16,5.71 24.77,5.71 22.64,3.59 JP2.4
PC4
  Top 0.254: IC1.24 44.2,5.96 46.64,3.52 JP2.16
PC5
  Top 0.254: IC1.25 44.7,6.42 48.32,2.79 JP2.17
PC10  (via drill 0.4)
  Top 0.254: IC1.51 47.2,29.74 48.42,30.96 v48.42,32.23
  Bottom 0.254: v48.42,32.23 48.42,32.38 48.42,37.88 JP3.9
PC11  (via drill 0.4)
  Top 0.254: IC1.52 46.7,30.03 47.62,30.96 v47.62,32.86
  Bottom 0.254: v47.62,32.86 47.62,36.35 46.64,37.34 JP3.10
PC12  (via drill 0.4)
  Top 0.254: IC1.53 46.2,30.32 46.83,30.96 v46.83,32.07
  Bottom 0.254: v46.83,32.07 46.83,35.72 44.64,37.91 JP3.11
PC13
  Top 0.254: IC1.2 37.71,23.57 37.47,23.81 37.47,33.34 32.7,38.1 JP3.17
PD2  (via drill 0.4)
  Top 0.254: IC1.54 45.7,30.94 v46.04,31.27
  Bottom 0.254: v46.04,31.27 46.04,35.56 44.77,36.83 43.91,36.83 JP3.12
SCL2  (via drill 0.4)
  Top 0.254: IC1.29 46.7,12.04 v47.15,10.79 | v47.15,10.79 | v47.15,10.79 47.31,10.64 47.31,6.67 48.9,5.08 53.34,3.49 JP2.20 | 25.4,12.38 arc23 v25.72,10.79 arc67 26.67,10.16 IC2.6
  Top 0.305: 25.4,12.38 R13.1
  Bottom 0.254: v47.15,10.79 46.83,11.11 26.67,11.11 arc37 v25.72,10.79
SDA2  (via drill 0.4)
  Top 0.254: IC1.30 47.2,12.49 47.94,11.75 v47.78,11.75 48.1,10.95 47.94,10.48 47.94,6.99 49.21,5.71 55.05,3.65 JP2.21 | 23.81,12.38 arc46 v24.77,10.16 arc42 IC2.5
  Top 0.305: 23.81,12.38 R14.1
  Bottom 0.254: v47.78,11.75 25.72,11.75 arc90 24.77,10.79 v24.77,10.16
SPI2_MISO
  Top 0.254: IC1.35 51.33,17.57 52.07,16.83 52.07,7.62 52.7,6.99 61.6,3.81 JP2.24
SPI2_MOSI
  Top 0.254: IC1.36 51.78,18.07 52.7,17.14 52.7,8.26 53.34,7.62 63.5,3.81 JP2.25
SPI2_NSS
  Top 0.254: IC1.33 50.8,15.92 50.8,6.35 51.44,5.71 57.15,3.81 JP2.22
SPI2_SCLK
  Top 0.254: IC1.34 50.88,17.07 51.44,16.51 51.44,6.99 52.07,6.35 59.69,3.81 JP2.23
SWCLK  (via drill 0.4)
  Top 0.254: IC1.49 48.2,27.25 49.21,28.26 v52.39,28.26 | JP4.3 R20.1
  Bottom 0.254: v52.39,28.26 52.7,28.57 67.31,28.57 71.75,33.02 JP4.3
SWDIO  (via drill 0.4)
  Top 0.254: IC1.46 52.6,23.07 53.02,23.5 53.02,24.45 51.75,25.72 v51.44,25.72 | JP4.2 R21.1
  Bottom 0.254: v51.44,25.72 51.44,28.57 52.07,29.21 66.67,29.21 72.39,34.92 72.39,35.05 JP4.2
TIM3_CH1
  Top 0.254: IC1.37 60.48,18.57 62.23,20.32 62.23,35.69 JP3.1
TIM3_CH2
  Top 0.254: IC1.38 60.03,19.07 61.6,20.64 61.6,37.05 JP3.2
TIM3_CH3
  Top 0.254: IC1.39 59.58,19.57 60.96,20.95 60.96,37.78 JP3.3
TIM3_CH4
  Top 0.254: IC1.40 59.12,20.07 60.33,21.27 60.33,36.41 JP3.4
TIM4_CH1
  Top 0.254: JP3.5 56.52,38.1 53.98,35.56 51.28,35.56 50.64,34.92 45.4,34.92 43.5,33.02 43.5,28.26 43.7,28.05 IC1.58
TIM4_CH2
  Top 0.254: JP3.6 52.73,36.2 51.12,36.2 50.48,35.56 45.09,35.56 42.86,33.34 42.86,27.94 43.2,27.6 IC1.59
TIM4_CH3
  Top 0.254: IC1.61 42.2,33.63 44.77,36.2 50.32,36.2 50.96,36.83 51.37,36.83 JP3.7
TIM4_CH4
  Top 0.254: IC1.62 41.7,34.08 44.45,36.83 49.53,36.83 50.64,37.94 JP3.8
VBAT
  Top 0.254: JP3.15 36.64,37.02 37.02,36.64 C15.1 37.02,34.73 38.1,33.66 38.1,24.13 38.16,24.07 IC1.1
VDDA  (via drill 0.4)
  Top 0.254: IC1.13 37.18,18.07 v36.83,18.26 L1.2
  Top 0.305: JP2.6 26.8,2.7 C16.1 30.16,4.76 32.38,6.99 32.38,14.61 35.69,17.91 L1.2
  Bottom 0.254: C6.1 36.99,18.41 v36.83,18.26